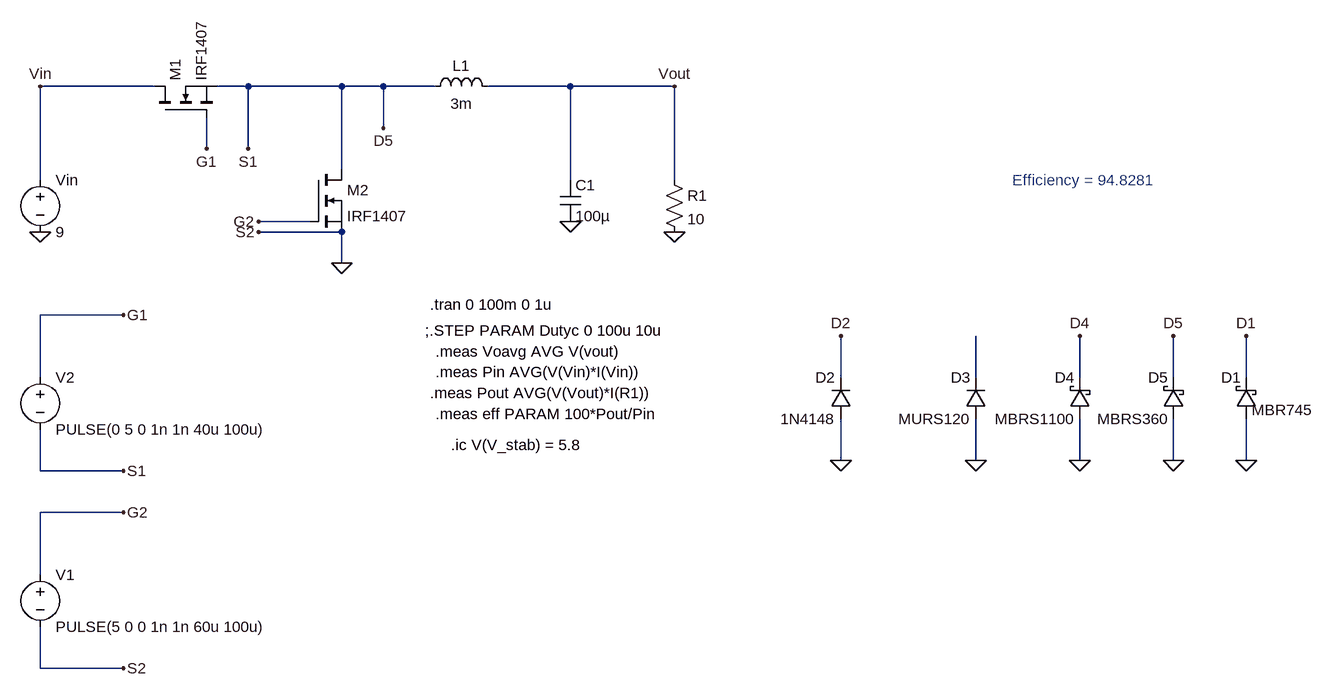
[diagram p0: schematic Synchro9V.asc]
Synchro9V.asc, the LTspice schematic file:
Version 4
SHEET 1 1908 860
WIRE 0 -96 -176 -96
WIRE 144 -96 96 -96
WIRE 288 -96 144 -96
WIRE 352 -96 288 -96
WIRE 432 -96 352 -96
WIRE 640 -96 512 -96
WIRE 800 -96 640 -96
WIRE 352 -32 352 -96
WIRE 80 0 80 -48
WIRE 144 0 144 -96
WIRE 288 32 288 -96
WIRE -176 48 -176 -96
WIRE 640 48 640 -96
WIRE 800 48 800 -96
WIRE 240 112 160 112
WIRE 288 128 160 128
WIRE 288 176 288 128
WIRE -48 256 -176 256
WIRE -176 352 -176 256
WIRE 1056 352 1056 288
WIRE 1264 352 1264 288
WIRE 1424 352 1424 288
WIRE 1568 352 1568 288
WIRE 1680 352 1680 288
WIRE 1056 480 1056 416
WIRE 1264 480 1264 416
WIRE 1424 480 1424 416
WIRE 1568 480 1568 416
WIRE 1680 480 1680 416
WIRE -176 496 -176 432
WIRE -48 496 -176 496
WIRE -48 560 -176 560
WIRE -176 656 -176 560
WIRE -176 800 -176 736
WIRE -48 800 -176 800
FLAG -176 128 0
FLAG 640 112 0
FLAG 800 128 0
FLAG -48 256 G1
FLAG -48 496 S1
FLAG -176 -96 Vin
FLAG 800 -96 Vout
FLAG -48 560 G2
FLAG -48 800 S2
FLAG 160 112 G2
FLAG 160 128 S2
FLAG 1056 480 0
FLAG 1264 480 0
FLAG 1424 480 0
FLAG 1568 480 0
FLAG 1680 480 0
FLAG 288 176 0
FLAG 80 0 G1
FLAG 144 0 S1
FLAG 352 -32 D5
FLAG 1680 288 D1
FLAG 1056 288 D2
FLAG 1568 288 D5
FLAG 1424 288 D4
SYMBOL nmos 0 -48 R270
SYMATTR InstName M1
SYMATTR Value IRF1407
SYMBOL voltage -176 32 R0
WINDOW 123 0 0 Left 0
WINDOW 39 0 0 Left 0
SYMATTR InstName Vin
SYMATTR Value 9
SYMBOL voltage -176 336 R0
WINDOW 123 0 0 Left 0
WINDOW 39 0 0 Left 0
SYMATTR InstName V2
SYMATTR Value PULSE(0 5 0 1n 1n 40u 100u)
SYMBOL ind 416 -80 R270
WINDOW 0 32 56 VTop 2
WINDOW 3 5 56 VBottom 2
SYMATTR InstName L1
SYMATTR Value 3m
SYMBOL cap 624 48 R0
SYMATTR InstName C1
SYMATTR Value 100µ
SYMBOL res 784 32 R0
SYMATTR InstName R1
SYMATTR Value 10
SYMBOL voltage -176 640 R0
WINDOW 123 0 0 Left 0
WINDOW 39 0 0 Left 0
SYMATTR InstName V1
SYMATTR Value PULSE(5 0 0 1n 1n 60u 100u)
SYMBOL nmos 240 32 R0
SYMATTR InstName M2
SYMATTR Value IRF1407
SYMBOL schottky 1696 416 R180
WINDOW 0 24 64 Left 2
WINDOW 3 -86 14 Left 2
SYMATTR InstName D1
SYMATTR Value MBR745
SYMATTR Description Diode
SYMATTR Type diode
SYMBOL diode 1072 416 R180
WINDOW 0 24 64 Left 2
WINDOW 3 24 0 Left 2
SYMATTR InstName D2
SYMATTR Value 1N4148
SYMBOL diode 1280 416 R180
WINDOW 0 24 64 Left 2
WINDOW 3 24 0 Left 2
SYMATTR InstName D3
SYMATTR Value MURS120
SYMBOL schottky 1440 416 R180
WINDOW 0 24 64 Left 2
WINDOW 3 24 0 Left 2
SYMATTR InstName D4
SYMATTR Value MBRS1100
SYMATTR Description Diode
SYMATTR Type diode
SYMBOL schottky 1584 416 R180
WINDOW 0 24 64 Left 2
WINDOW 3 24 0 Left 2
SYMATTR InstName D5
SYMATTR Value MBRS360
SYMATTR Description Diode
SYMATTR Type diode
TEXT 416 280 Left 2 !;.STEP PARAM Dutyc 0 100u 10u
TEXT 424 240 Left 2 !.tran 0 100m 0 1u
TEXT 432 312 Left 2 !.meas Voavg AVG V(vout)
TEXT 432 344 Left 2 !.meas Pin AVG(V(Vin)*I(Vin))
TEXT 424 376 Left 2 !.meas Pout AVG(V(Vout)*I(R1))
TEXT 432 408 Left 2 !.meas eff PARAM 100*Pout/Pin
TEXT 1320 48 Left 2 ;Efficiency = 94.8281
TEXT 456 456 Left 2 !.ic V(V_stab) = 5.8

The netlist it stands for:
* Synchro9V.asc
M1 Vin G1 D5 D5 IRF1407
Vin Vin 0 9
V2 G1 D5 PULSE(0 5 0 1n 1n 40u 100u)
L1 D5 Vout 3m
C1 Vout 0 100µ
R1 Vout 0 10
V1 G2 0 PULSE(5 0 0 1n 1n 60u 100u)
M2 D5 G2 0 0 IRF1407
D1 0 D1 MBR745
D2 0 D2 1N4148
D3 0 N001 MURS120
D4 0 D4 MBRS1100
D5 0 D5 MBRS360
.model D D
.lib standard.dio
.model NMOS NMOS
.model PMOS PMOS
.lib standard.mos
;.STEP PARAM Dutyc 0 100u 10u
.tran 0 100m 0 1u
.meas Voavg AVG V(vout)
.meas Pin AVG(V(Vin)*I(Vin))
.meas Pout AVG(V(Vout)*I(R1))
.meas eff PARAM 100*Pout/Pin
* Efficiency = 94.8281
.ic V(V_stab) = 5.8
.backanno
.end